# Altium schematic sheet LoRa.SchDoc: LoRa
size A4; SheetNumber: 6; SheetTotal: 13
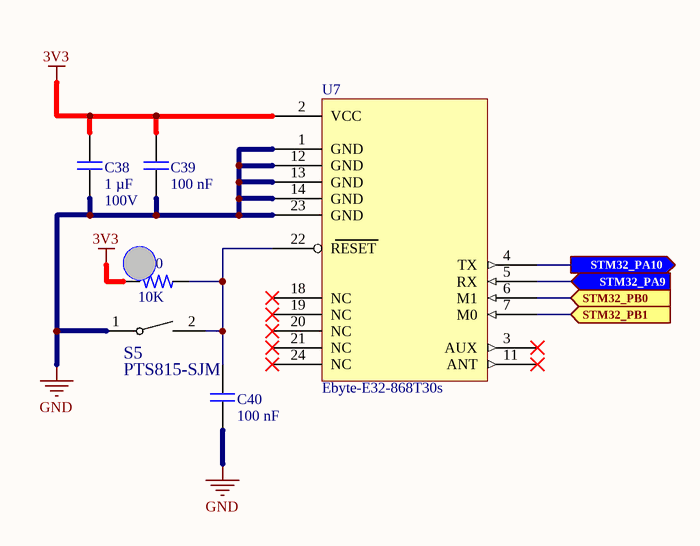
[diagram p0: LoRa.SchDoc]

## Parts
C38  1 µF  Voltage Rating: 100V  [MergenElektronik_Capacitors_Ceramics_SMDs_1206_M_NS]
C39  100 nF  [MergenElektronik_Capacitors_Ceramics_SMDs_0603_M_NS]
C40  100 nF  [MergenElektronik_Capacitors_Ceramics_SMDs_0603_M_NS]
R30  10K  [MergenElektronik_Resistors_ChipResistors_0603_M_NS]
S5  PTS815-SJM  [MergenElektronik_Switches_TactileSwitches_PTS815]
U7  Ebyte-E32-868T30s  [MergenElektronik_Modules_LoRas_Ebyte-E32-xxxxT30x]

## Ports
STM32_PA9 (in, see Microcontroller[2C]), STM32_PA10 (out, see Microcontroller[2C]), STM32_PB0 (in, see Microcontroller[3C]), STM32_PB1 (in, see Microcontroller[3C])

## Nets
3V3: C38.1 C39.1 R30.1 U7.2(VCC)
GND: C38.2 C39.2 C40.2 S5.1 U7.1(GND) U7.12(GND) U7.13(GND) U7.14(GND) U7.23(GND)
STM32_PA9: U7.5(RX) ; port STM32_PA9
STM32_PA10: U7.4(TX) ; port STM32_PA10
STM32_PB0: U7.6(M1) ; port STM32_PB0
STM32_PB1: U7.7(M0) ; port STM32_PB1
NetC40_1: C40.1 R30.2 S5.2 U7.22(RESET)

Not connected (* = marked no-connect by the designer): U7 3(AUX)* 11(ANT)* 18(NC)* 19(NC)* 20(NC)* 21(NC)* 24(NC)*

## Notes on the sheet
- Title:
- Size:
- Date:
- A4
- Number:
- Time:
- Revision:
- Sheet
- of
- Project
- Drawn By :

## Library data of the parts
C38 = MergenElektronik_Capacitors_Ceramic_SMDs_1µF_100V: Mergen Elektronik - Capacitors - Ceramics - SMDs - 1206 - 1 µF - 100V; Manufacturer: Samsung Electro-Mechanics; Manufacturer Number: CL31B105KCHNNNE; Model: Ceramic Capacitors; Tolerance: ±10%; Value: 1 µF; Temperature: -55°C up to +125°C; Digi-Key Number: 1276-1838-1-ND; Package: 1206(3216 Metric); Mouser Number: 187-CL31B105KCHNNNE; Mounting Type: Surface Mount; Özdisan Number: CL31B105KCHNNNE; Supplier 1: Digikey; Supplier 2: Mouser; Supplier Part Number 1: 1276-1838-1-ND; Supplier Part Number 2: 187-CL31B105KCHNNNE
C39 C40 = MergenElektronik_Capacitors_Ceramic_SMDs_100nF_100V: Mergen Elektronik - Capacitors - Ceramics - SMDs - 0603 - 100 nF - 100V; Manufacturer: Samsung Electro-Mechanics; Manufacturer Number: CL10B104KC8NNNC; Model: Ceramic Capacitors; Tolerance: ±10%; Value: 100 nF; Temperature: -55°C up to +125°C; Digi-Key Number: 1276-6807-1-ND; Package: 0603(1608 Metric); Mouser Number: 187-CL10B104KC8NNNC; Mounting Type: Surface Mount; Farnell Number: 3013412; Özdisan Number: CL10B104KC8NNNC; Supplier 1: Digikey; Supplier 2: Mouser; Supplier Part Number 1: 1276-6807-1-ND; Supplier Part Number 2: 187-CL10B104KC8NNNC; Voltage Rating: 100V
R30 = MergenElektronik_Resistors_ChipResistors_0603_10K: Mergen Elektronik - Resistors - Chip Resistors - 0603 - 10K; Manufacturer: Stackpole Electronics Inc; Manufacturer Number: RMCF0603JT10K0; Value: Chip Resistor - 0603 - 10K; Power: 1/10W; Tolerance: ±5%; Package: 0603(1608); Temperature: -55°C up to +155°C - X8R; Model: Chip Resistor; Digi-Key Number: RMCF0603JT10K0CT-ND; Mounting Type: Surface Mount; Supplier 1: Digi-Key; Supplier Part Number 1: RMCF0603JT10K0-ND
S5 = MergenElektronik_Switches_TactileSwitches_PTS815-SJM: Mergen Elektronik - Switches - Tactile  Switches; Manufacturer Number: PTS815 SJM 250 SMTR LFS; Manufacturer: C&K; Current Rating: 50mA; Voltage Rating: 12VDC; Digi-Key Number: CKN12215-1-ND; Model: Tactile Switches; Mounting Type: Surface Mount; Package: PTS815; Temperature: -20°C up to +70°C; Value: PTS815-SJM; Mouser Number: 611-PTS815SJM250SMTR; Farnell Number: 3780619; Supplier 1: Mouser; Supplier 2: Digi-Key; Supplier Part Number 1: 611-PTS815SJM250SMTR; Supplier Part Number 2: CKN12215-6-ND
U7 = MergenElektronik_Modules_LoRas_Ebyte-E32-868T30s: Mergen Elektronik - Modules - LoRas - Ebyte-E32-868T30s; Manufacturer: Ebyte; Distance: 8 km; Interface: UART; Power: 30dBm; Frequency: 862-893MHz; IC: SX1276; Manufacturer Number: E32-868T30s